# EasyEDA Pro project XRAY.epro, schematic X射线管驱动电路_精简版
Create Date: 2023-10-05; Page Name: main; Project Name: X-RAY; Schematic Name: X射线管驱动电路_精简版; Update Date: 2023-10-05; Company: TCLAB; Drawed: 杨浩天; Page Size: A3; Version: V1.0
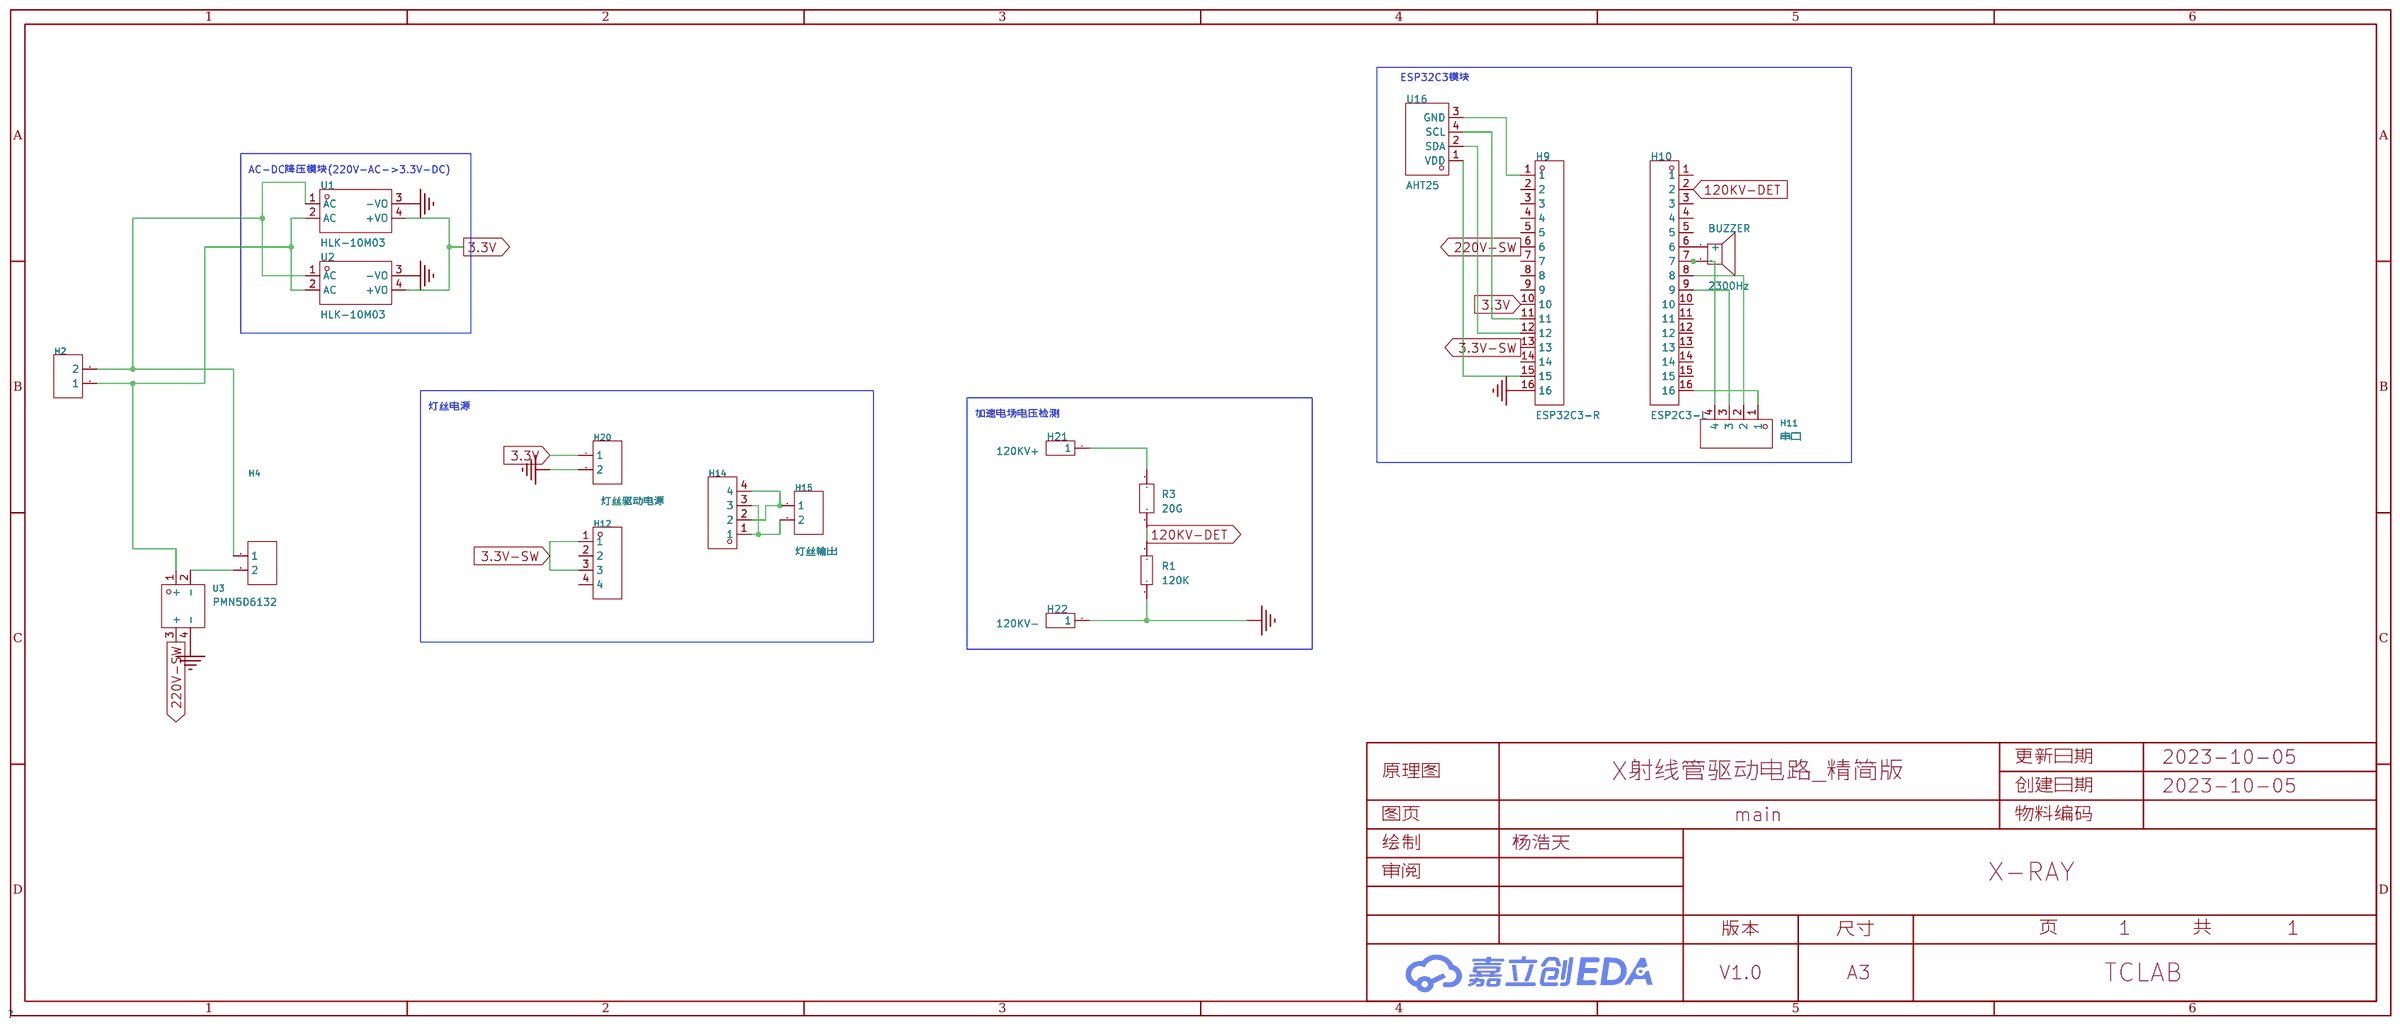
[diagram p1: schematic sheet]

## Parts
BUZZER  2300Hz  [BUZ-TH_BD12.0-P7.60-D0.6-FD]
H2  -  [HDR-TH_2P-P2.54-V-F]
H4  -  [HDR-TH_2P-P2.54-V-F]
H9  ESP32C3-R  [HDR-TH_16P-P2.54-V-F]
H10  ESP2C3-L  [HDR-TH_16P-P2.54-V-F]
H11  串口  [HDR-TH_4P-P2.54-V-F]
H12  -  [HDR-TH_4P-P2.54-V-F]
H14  -  [HDR-TH_4P-P2.54-V-F]
H15  灯丝输出  [HDR-TH_2P-P2.54-V-F]
H20  灯丝驱动电源  [HDR-TH_2P-P2.54-V-F]
H21  120KV+  [HDR-TH_1P-V-M_XKB_X4611WV-01I-C28D40]
H22  120KV-  [HDR-TH_1P-V-M_XKB_X4611WV-01I-C28D40]
R1  120K  [R0603]
R3  20G  [RES-TH_BD7.0-L25.0-P31.00-D1.0]
U1  HLK-10M03  [PWRM-TH_HLK-10M05]
U2  HLK-10M03  [PWRM-TH_HLK-10M05]
U3  PMN5D6132  [DIP-4_L43.2-W12.0-PMN5A2032]
U16  AHT25  [SENSOR-TH_AHT25]

## Library data of the parts
BUZZER = TMB12A03: 驱动方式:有源(内含驱动线路);构造类型:电磁式;额定电压:3V;工作电压:1.5V~4V;频率:2300Hz;声压(SPL):85dB@3V,10cm;直径(φD):12mm;高度:9.8mm;; Supplier Part: C96222; Manufacturer: 华能; Supplier Footprint: 插件,D=12mm; JLCPCB Part Class: 扩展库; Datasheet: https://atta.szlcsc.com/upload/public/pdf/source/20211202/CAFCFF4D10B388AA00F36865319470DA.pdf; Supplier: LCSC; Oscillator Circuit: 有源(内含驱动线路); Technology Type: 电磁式; Rated Voltage: 3V; Operating Voltage: 1.5V~4V; Sound Pressure Level (SPL): 85dB@3V,10cm; Diameter (φD): 12mm; Height: 9.8mm
H2 H4 H15 H20 = HDR-F_2.54_1x2P: Supplier Part: C49661; Supplier Footprint: 插件
H9 H10 = HDR-F_2.54_1x16P: Supplier Part: C124409; Supplier Footprint: 插件
H11 H12 H14 = HDR-F_2.54_1x4P: Supplier Part: C2718488; Supplier Footprint: 插件
H21 H22 = HDR-M_2.54_1x1P: Supplier Part: C81276; Supplier Footprint: 插件; JLCPCB Part Class: Extended Part
R1 = Res_0603: Supplier Footprint: 0603
R3 = RI80-2大红袍金属膜玻璃釉无感高频高压电阻: Supplier Part: C9900022121; Supplier Footprint: TH-2P; JLCPCB Part Class: 扩展库; Datasheet: https://atta.szlcsc.comnull; Supplier: LCSC
U1 U2 = HLK-10M05: 转换类型:AC-DC;是否隔离稳压:隔离稳压;输出路数:1;输入电压(AC):90VAC~265VAC;输入电压(DC):120V~350V;输出电压:5V;输出电流(最大值):2A;输出功率:10W;转换效率:80%;特性:过流保护；短路保护;; LCSC Part Name: Vin=90VAC~265VAC Vin=120V~350V Vout=5V 2A; Supplier Part: C403745; Manufacturer: HI-LINK(海凌科); Supplier Footprint: 插件; JLCPCB Part Class: 扩展库; Supplier: LCSC; Conversion Type: AC-DC; Function: 降压型; Isolated Or Voltage Regulation: 隔离稳压; Output Channel: 1; Input Voltage(AC): 90VAC~265VAC; Input Voltage(DC): 120V~350V; Output Voltage: 5V; Output Current (Max): 2A; Output Power: 10W; Insulated Voltage: 3kV@AC; Conversion Efficiency: 80%; Feature: 过流保护；短路保护
U3 = PMN5D6132: Supplier Part: C9900058237; Supplier Footprint: SIP 12×43.18; Supplier: LCSC
U16 = AHT25: LCSC Part Name: 温湿度传感器模块; Supplier Part: C3012623; Manufacturer: 广州奥松; Supplier Footprint: SIP-4; JLCPCB Part Class: 扩展库; Datasheet: https://atta.szlcsc.com/upload/public/pdf/source/20220512/86D44EA6624D51CD987FED8DDE448F4C.pdf; Supplier: LCSC

## Nets
3.3V: H9.10 H20.1 U1.4(+VO) U2.4(+VO)
3.3V-SW: H9.13 H12.1 H12.3
220V-SW: H9.6 U3.3(+)
GND: H9.16 H20.2 H22.1 R1.2 U1.3(-VO) U2.3(-VO) U3.4(-)
120KV-DET: H10.2 R1.1 R3.1
$1N1416: H4.2 U3.2(-)
$1N4648: H10.16 H11.1
$1N4656: H10.8 H11.2
$1N4664: H10.9 H11.3
$1N4672: BUZZER.2 H10.7 H11.4
$1N5062: H14.2 H14.4 H15.1
$1N5074: H14.1 H14.3 H15.2
$1N10162: H21.1 R3.2
$1N11280: H2.1 U1.2(AC) U2.2(AC) U3.1(+)
$1N11281: H2.2 H4.1 U1.1(AC) U2.1(AC)
$1N12469: H9.15 U16.1(VDD)
$1N12482: H9.12 U16.2(SDA)
$1N12487: H9.11 U16.4(SCL)
$1N12492: H9.1 U16.3(GND)
$1N12533: BUZZER.1(+) H10.6

Not connected (* = marked no-connect by the designer): H9 2 3 4 5 7 8 9 14; H10 1 3 4 5 10 11 12 13 14 15; H12 2 4

## Notes on the sheet
- ESP32C3模块
- AC-DC降压模块(220V-AC->3.3V-DC)
- 灯丝电源
- 加速电场电压检测
